# Altium project Fuente.PrjPcb
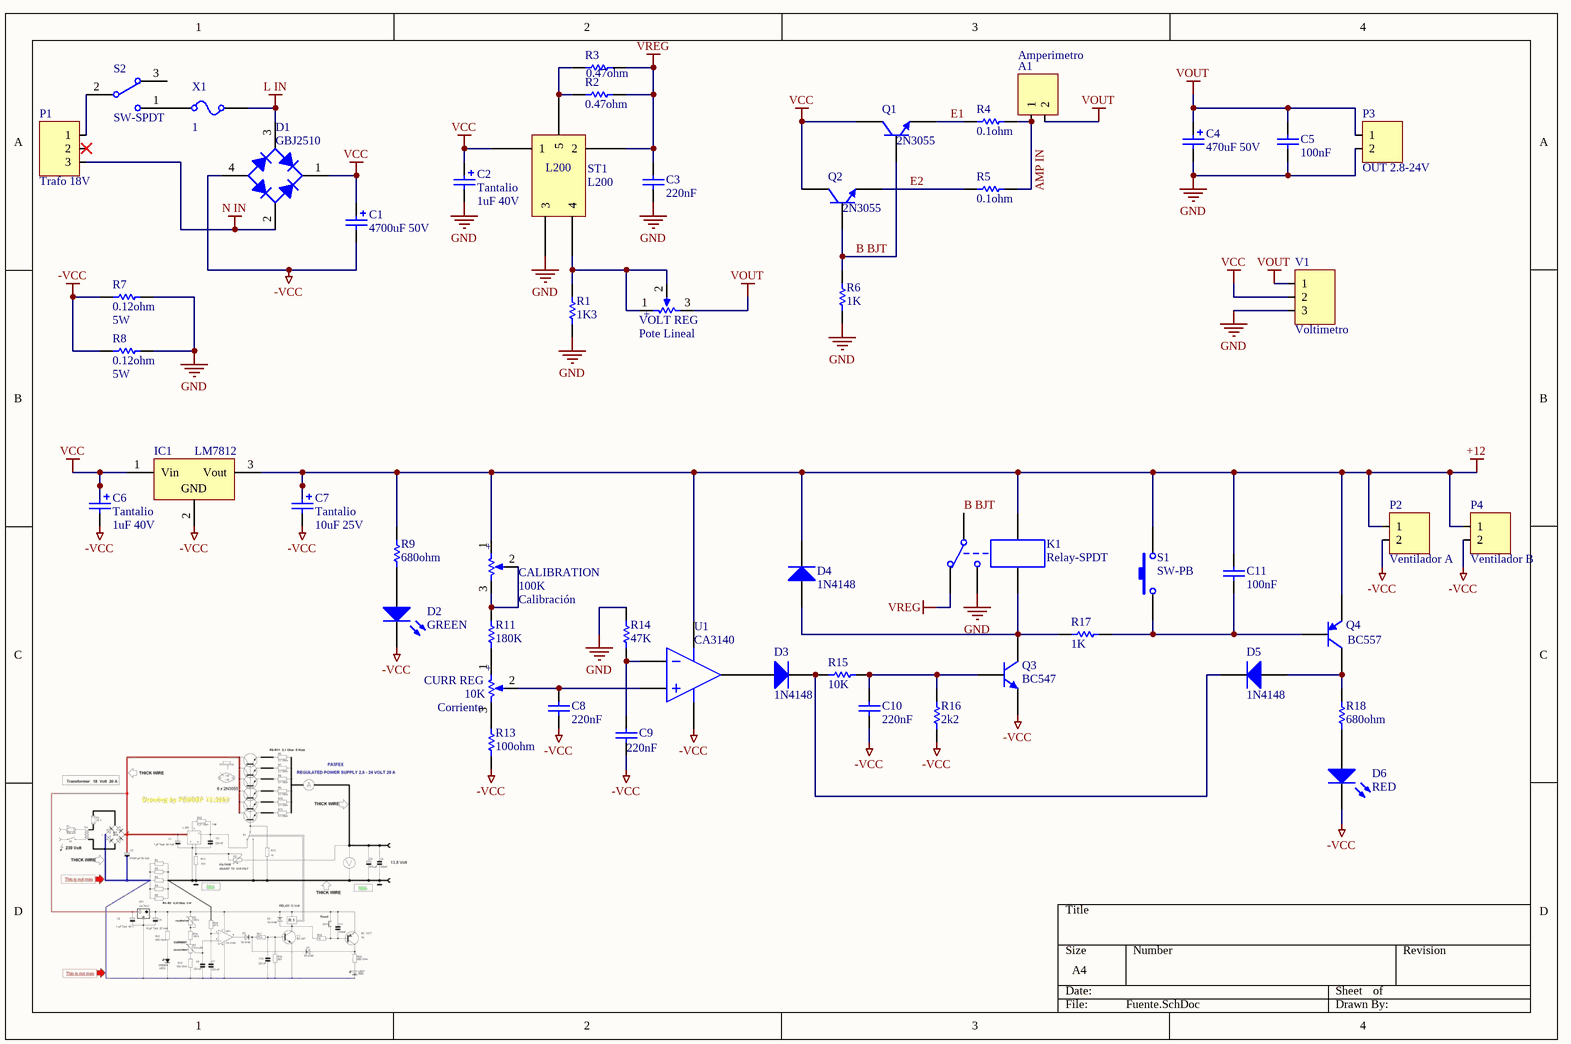
[diagram p0: Fuente.SchDoc]
1 sheet, 53 parts. Net scope: global (net labels, ports and power ports of the same name join across sheets).
Board files: Fuente.PcbDoc, ARRAY.PcbDoc

## Sheet Fuente.SchDoc
size A4; SheetNumber: 1; SheetTotal: 1

### Parts
A1  Amperimetro  [BORNERA 2]
C1  4700uF 50V  [CAP 20MM]
C2  Tantalio  value 1uF 40V  [Cap Tantalio]
C3  220nF  [1206 res]
C4  470uF 50V  [CAP 10mm]
C5  100nF  [0805 res]
C6  Tantalio  value 1uF 40V  [Cap Tantalio]
C7  Tantalio  value 10uF 25V  [Cap Tantalio]
C8  220nF  [1206 res]
C9  220nF  [1206 res]
C10  220nF  [1206 res]
C11  100nF  [0805 res]
CALIBRATION  100K  [Potenciometro]
CURR_REG  10K  [Potenciometro]
D1  GBJ2510  [DIOB_GBJ2510]
D2  GREEN  [LED 5MM GREEN]
D3  1N4148  [DO-38]
D4  1N4148  [DO-38]
D5  1N4148  [DO-38]
D6  RED  [LED 5MM]
IC1  LM7812  [TO220]
K1  Relay-SPDT  [Relay]
P1  Trafo 18V  [Bornera 3]
P2  Ventilador A  [HDR1X2]
P3  OUT 2.8-24V  [BORNERA 2]
P4  Ventilador B  [HDR1X2]
Q1  2N3055  [Bornera 3]
Q2  2N3055  [Bornera 3]
Q3  BC547  [TO-92A]
Q4  BC557  [TO-92A]
R1  1K3  [1206 res]
R2  0.47ohm  [Res Axial 0.5]
R3  0.47ohm  [Res Axial 0.5]
R4  0.1ohm  [RES AXIAL 5W]
R5  0.1ohm  [RES AXIAL 5W]
R6  1K  [1206 res]
R7  0.12ohm  value 5W  [RES AXIAL 5W]
R8  0.12ohm  value 5W  [RES AXIAL 5W]
R9  680ohm  [1206 res]
R11  180K  [1206 res]
R13  100ohm  [1206 res]
R14  47K  [1206 res]
R15  10K  [1206 res]
R16  2k2  [1206 res]
R17  1K  [1206 res]
R18  680ohm  [1206 res]
S1  SW-PB  [Pulsador]
S2  SW-SPDT  [Bornera 3]
ST1  L200  [PENTAWATT]
U1  Amplificador Operacional  [DIP8]  (value not drawn)
V1  Voltimetro  [HDR1X3]
VOLT_REG  Pote Lineal  [Potenciometro]
X1  CURRENT: 1  [Fusiblera]  (hidden comment: Fuse)

### Nets
+12: C7.1 C11.2 CALIBRATION.1(TOP) D4.2(K) IC1.3(Vout) K1.1 P2.1 P4.1 Q4.3(E) R9.2 S1.2 U1.7(V+)
-VCC: C1.2 C6.2 C7.2 C8.1 C9.1 C10.1 D1.4(A) D2.2(K) D6.2(K) IC1.2(GND) P2.2 P4.2 Q3.3(E) R7.1 R8.1 R13.1 R16.1 U1.4(V-)
GND: C2.2 C3.1 C4.2 C5.1 K1.5 P3.1(2) R1.1 R6.1 R7.2 R8.2 R14.2 ST1.3 V1.3
L IN: D1.3(C) X1.2
N IN: D1.2(C) P1.3
VCC: C1.1 C2.1 C6.1 D1.1(K) IC1.1(Vin) Q1.3(C) Q2.1(C) ST1.1 V1.2
VOUT: A1.2 C4.1 C5.2 P3.2(1) V1.1 VOLT_REG.3(BOTTOM)
VREG: C3.2 K1.4 R2.2 R3.2 ST1.2
AMP IN: A1.1 R4.2 R5.2
B BJT: K1.3 Q1.2(B) Q2.2(B) R6.2
E1: Q1.1(E) R4.1
E2: Q2.3(E) R5.1
NetC8_2: C8.2 CURR_REG.2(TAP) U1.3(IN+)
NetC9_2: C9.2 R14.1 U1.2(IN-)
NetC10_2: C10.2 Q3.2(B) R15.2 R16.2
NetC11_1: C11.1 Q4.2(B) R17.2 S1.1
NetCALIBRATION_2: CALIBRATION.2(TAP) CALIBRATION.3(BOTTOM) R11.2
NetCURR_REG_1: CURR_REG.1(TOP) R11.1
NetCURR_REG_3: CURR_REG.3(BOTTOM) R13.2
NetD2_1: D2.1(A) R9.1
NetD3_1: D3.1(A) U1.6(OUT)
NetD3_2: D3.2(K) D5.2(K) R15.1
NetD4_1: D4.1(A) K1.2 Q3.1(C) R17.1
NetD5_1: D5.1(A) Q4.1(C) R18.2
NetD6_1: D6.1(A) R18.1
NetP1_1: P1.1 S2.2
NetR1_2: R1.2 ST1.4 VOLT_REG.1(TOP) VOLT_REG.2(TAP)
NetR2_1: R2.1 R3.1 ST1.5
NetS2_1: S2.1 X1.1

Not connected (* = marked no-connect by the designer): P1 2*; S2 3

### Notes on the sheet
- Calibración
- (near U1) CA3140
- (near CURR_REG) Corriente
- (in symbol Potenciometro) +

### Library data of the parts
A1 P3 = Bornera: Header, 2-Pin; LatestRevisionDate: 17-Jul-2002; LatestRevisionNote: Re-released for DXP Platform.; Publisher: Altium Limited
C1 C2 C4 C6 C7 = Cap Pol1: Polarized Capacitor (Radial); Published: 8-Jun-2000; LatestRevisionDate: 17-Jul-2002; LatestRevisionNote: Re-released for DXP Platform.; PackageReference: RB7.6-15; Publisher: Altium Limited; PackageDescription: Polarized Capacitor (Radial); 2 Leads
C3 C5 C8-C11 = Cap: Capacitor; Published: 8-Jun-2000; LatestRevisionDate: 17-Jul-2002; LatestRevisionNote: Re-released for DXP Platform.; PackageReference: RAD-0.3; Publisher: Altium Limited; PackageDescription: Radial Cap, Thru-Hole; 2 Leads; 0.3 in Pin Spacing
CALIBRATION CURR_REG VOLT_REG = Potenciometro
D1 = Bridge1: Full Wave Diode Bridge; Published: 8-Jun-2000; LatestRevisionDate: 29-May-2009; LatestRevisionNote: Sch pins A & K swapped.; DatasheetVersion: E2732B; PackageReference: D-38; Publisher: Altium Limited; PackageDescription: Bridge Rectifier; 4 Terminals; Body 9.4 x 9.4 mm (typ); Pitch 5.08 mm
D2 D6 = LED5: Typical BLUE SiC LED; Published: 8-Jun-2000; LatestRevisionDate: 17-Dec-2003; LatestRevisionNote: PCB Footprint replaced.; DatasheetVersion: 16-Apr-2002; PackageVersion: 16-Apr-2002; PackageReference: 3.5X2.8X1.9; Publisher: Altium Limited; PackageDescription: SM LED; 2 C-Bend Leads; Body 3.5 x 2.8 x 1.9 mm, inc leads (LxWxH typ)
D3-D5 = Diode 1N4007: 1 Amp General Purpose Rectifier; Published: 8-Jun-2000; LatestRevisionDate: 17-Jul-2002; LatestRevisionNote: Re-released for DXP Platform.; DatasheetVersion: 1998; PackageVersion: Aug-1999; PackageReference: DO-41; Publisher: Altium Limited; PackageDescription: Diode, Axial; Body 5.2 x 2.7 mm (LxDia. max), Lead Dia. 0.86 mm (max); Code_JEDEC: DO-204-AL; ComponentLink1Description: Manufacturer Link; ComponentLink1URL: http://www.fairchildsemi.com/; ComponentLink2Description: Datasheet; ComponentLink2URL: http://www.fairchildsemi.com/ds/1N%2F1N4001.pdf
K1 = Relay-SPDT: Single-Pole Dual-Throw Relay; Published: 24-Mar-1999; LatestRevisionDate: 17-Jul-2002; LatestRevisionNote: Re-released for DXP Platform.; PackageReference: MODULE5B; Publisher: Altium Limited
P1 = Bornera 3pin: Header, 3-Pin; LatestRevisionDate: 17-Jul-2002; LatestRevisionNote: Re-released for DXP Platform.; Publisher: Altium Limited
P2 P4 = Header 2: Header, 2-Pin; LatestRevisionDate: 17-Jul-2002; LatestRevisionNote: Re-released for DXP Platform.; Publisher: Altium Limited
Q1-Q3 = BC547: NPN General Purpose Amplifier; Published: 8-Jun-2000; LatestRevisionDate: 15-Jan-2003; LatestRevisionNote: PCB Footprint 'BCY-W3/D4.7' replaced; DatasheetVersion: 1997; PackageVersion: Sep-1998; PackageReference: TO-92A; Publisher: Altium Limited; PackageDescription: TO, Flat Index; 3 In-Line, Axial Leads; Body Dia. 4.5mm; Leads 0.51 x 0.48 mm (max); ComponentLink1Description: Manufacturer Link; ComponentLink1URL: http://www.fairchildsemi.com/; ComponentLink2Description: Datasheet; ComponentLink2URL: http://www.fairchildsemi.com/ds/2N%2F2N3904.pdf
Q4 = BJT PNP GP: Bipolar PNP 3 Pins Transistor Gummel-Poon Model; BF: 100; AF: 0; BR: 1; EG: 1.11; FC: 0.5; IS: 1e-16; MJC: 0.33; NC: 2; NE: 1.5; TNOM: 27; VBC_MAX: 1e99; VJC: 0.75; XTI: 3; SimulationGenericComponent: True; CJC: 0; CJE: 0; CJS: 0; CTC: 0; CTE: 0; CTS: 0; IKF: 0; IKR: 0; IRB: 0; ISC: 0; ISE: 0; ISS: 0; ITF: 0; KF: 0; MJE: 0.33; MJS: 0; NF: 1; NKF: 0.5; NR: 1; NS: 1; PTF: 0; RB: 0; RBM: 0; RC: 0; RE: 0; SUBS: 1; TBF1: 0; TBF2: 0; TBR1: 0; TBR2: 0; TF: 0; TIKF1: 0; TIKF2: 0; TIKR1: 0; TIKR2: 0; TIRB1: 0; TIRB2: 0; TIS1: 0; TIS2: 0; TISC1: 0; TISC2: 0; TISE1: 0; TISE2: 0; TITF1: 0; TITF2: 0; TLEV: 0; TLEVC: 0; TMJC1: 0; TMJC2: 0; TMJE1: 0; TMJE2: 0; TMJS1: 0; TMJS2: 0; TNC1: 0; TNC2: 0; TNE1: 0; TNE2: 0; TNF1: 0; TNF2: 0; TNR1: 0; TNR2: 0; TNS1: 0; TNS2: 0; TR: 0; TRB1: 0; TRB2: 0; TRC1: 0; TRC2: 0; TRE1: 0; TRE2: 0; TRM1: 0; TRM2: 0; TTF1: 0; TTF2: 0; TTR1: 0; TTR2: 0; TVAF1: 0; TVAF2: 0; TVAR1: 0; TVAR2: 0; TVJC: 0; TVJE: 0; TVJS: 0; VAF: 0; VAR: 0; VBE_MAX: 1e99; VCE_MAX: 1e99; VJE: 0.75; VJS: 0.75; VTF: 0; XCJC: 1; XTB: 0; XTF: 0
R1-R9 R11 R13-R18 = Res1: Resistor; Published: 8-Jun-2000; LatestRevisionDate: 17-Jul-2002; LatestRevisionNote: Re-released for DXP Platform.; PackageReference: AXIAL-0.3; Publisher: Altium Limited; PackageDescription: Axial Device, Thru-Hole; 2 Leads; 0.3 in Pin Spacing
S1 = SW-PNA: Switch; Published: 24-Mar-1999; LatestRevisionDate: 17-Jul-2002; LatestRevisionNote: Re-released for DXP Platform.; PackageReference: SPST-2; Publisher: Altium Limited; PackageDescription: Switch; 2 Leads
S2 = SW-SPDT: SPDT Subminiature Toggle Switch, Right Angle Mounting, Vertical Actuation; Published: 24-Mar-1999; LatestRevisionDate: 17-Dec-2003; LatestRevisionNote: Schematic revised, PCB Footprint replaced.; DatasheetVersion: 05-Dec-2000; PackageReference: TL36WW15050; Publisher: Altium Limited; PackageDescription: Switch; 4 Leads; ComponentLink1Description: Manufacturer Link; ComponentLink1URL: http://www.apem.com
U1 = OpAmp with power terminals: Ideal Operational Amplifier; SimulationGenericComponent: True
V1 = Header 3: Header, 3-Pin; LatestRevisionDate: 17-Jul-2002; LatestRevisionNote: Re-released for DXP Platform.; Publisher: Altium Limited
X1 = Fuse_1: RESISTANCE: 1m; SimulationGenericComponent: True